# Altium project Node.PrjPCB (part 1 of 3)
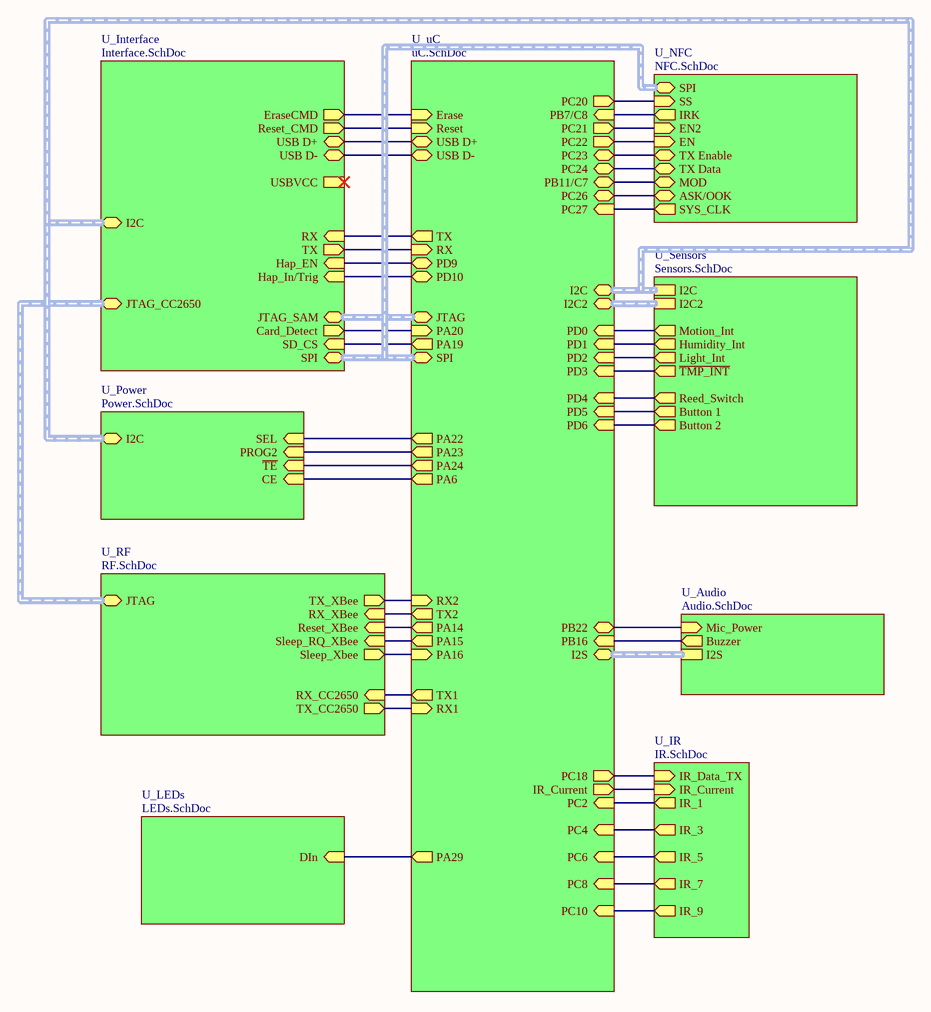
[diagram p0: Node.SchDoc]
11 sheets, 309 parts. Net scope: hierarchical (ports join the sheet entries above them; power ports are global).
Board file: Node.PcbDoc
Sheets:
  Node.SchDoc
    U_NFC = NFC.SchDoc
    U_Interface = Interface.SchDoc
      U_LevelShifter = LevelShifter.SchDoc
    U_IR = IR.SchDoc
    U_LEDs = LEDs.SchDoc
    U_Power = Power.SchDoc
    U_RF = RF.SchDoc
    U_uC = uC.SchDoc
    U_Sensors = Sensors.SchDoc
    U_Audio = Audio.SchDoc

## Sheet Node.SchDoc
size Letter

### Sub-sheets
U_Audio = Audio.SchDoc: Mic_Power (in), Buzzer (out), I2S (harness I2S)
U_Interface = Interface.SchDoc: USB D+ (bidir), USB D- (bidir), EraseCMD (out), Reset_CMD (out), USBVCC, Card_Detect (out), SD_CS (in), Hap_EN (in), Hap_In/Trig (in), SPI (harness SPI), JTAG_SAM (harness JTAG), JTAG_CC2650 (harness JTAG), I2C (harness I2C), RX (in), TX (out)
U_IR = IR.SchDoc: IR_1 (out), IR_3 (out), IR_5 (out), IR_7 (out), IR_9 (out), IR_Data_TX (in), IR_Current (in)
U_LEDs = LEDs.SchDoc: DIn (in)
U_NFC = NFC.SchDoc: MOD (bidir), IRK (out), ASK/OOK (bidir), SYS_CLK (out), EN2 (in), EN (in), TX Enable (bidir), TX Data (bidir), SS (in), SPI (harness SPI)
U_Power = Power.SchDoc: SEL (in), PROG2 (in), ~{TE} (in), CE (in), I2C (harness I2C)
U_RF = RF.SchDoc: RX_CC2650 (in), TX_CC2650 (out), TX_XBee (out), RX_XBee (in), Reset_XBee (in), Sleep_Xbee (out), Sleep_RQ_XBee (in), JTAG (harness JTAG)
U_Sensors = Sensors.SchDoc: Button 1 (out), Motion_Int (out), Humidity_Int (out), Light_Int (out), Reed_Switch (out), Button 2 (out), I2C (harness I2C), I2C2 (harness I2C), ~{TMP_INT} (out)
U_uC = uC.SchDoc: USB D+ (bidir), USB D- (bidir), IR_Current (out), Reset (in), Erase (in), I2C2 (harness I2C), I2C (harness I2C), JTAG (harness JTAG), SPI (harness SPI), I2S (harness I2S), TX (out), TX1 (out), RX (in), TX2 (out), RX1 (in), RX2 (in), PB16 (in), PB22 (bidir), PC4 (in), PC2 (in), PC6 (in), PC8 (in), PC10 (in), PC18 (out), PA20 (in), PA19 (out), PA22 (out), PA23 (out), PA24 (out), PA6 (out), PA29 (out), PC20 (out), PB7/C8 (in), PC22 (out), PC23 (bidir), PC24 (bidir), PB11/C7 (bidir), PC26 (bidir), PC27 (in), PD0 (in), PD1 (in), PD2 (in), PD5 (in), PD6 (in), PD3 (in), PD4 (in), PD9 (bidir), PD10 (bidir), PA15 (out), PA16 (in), PA14 (out), PC21 (out)

### Nets
CE: sheet U_Power/CE, sheet U_uC/PA6
PROG2: sheet U_Power/PROG2, sheet U_uC/PA23
Reset: sheet U_Interface/Reset_CMD, sheet U_uC/Reset
SAM_RX: sheet U_Interface/TX, sheet U_uC/RX
SAM_TX: sheet U_Interface/RX, sheet U_uC/TX
SEL: sheet U_Power/SEL, sheet U_uC/PA22
~{TE}: sheet U_Power/~{TE}, sheet U_uC/PA24
USB_1_N: sheet U_Interface/USB D-, sheet U_uC/USB D-
USB_1_P: sheet U_Interface/USB D+, sheet U_uC/USB D+
NetC7_2: sheet U_Interface/Hap_In/Trig, sheet U_uC/PD10
NetC12_1: sheet U_Interface/Card_Detect, sheet U_uC/PA20
NetC56_1: sheet U_uC/PD4, sheet U_Sensors/Reed_Switch
NetC60_1: sheet U_uC/PD5, sheet U_Sensors/Button 1
NetC64_1: sheet U_uC/PD6, sheet U_Sensors/Button 2
NetC115_2: sheet U_uC/PB22, sheet U_Audio/Mic_Power
NetCC1_41: sheet U_RF/RX_CC2650, sheet U_uC/TX1
NetCC1_42: sheet U_RF/TX_CC2650, sheet U_uC/RX1
NetJ1_2: sheet U_RF/TX_XBee, sheet U_uC/RX2
NetJ1_3: sheet U_RF/RX_XBee, sheet U_uC/TX2
NetJ1_5: sheet U_RF/Reset_XBee, sheet U_uC/PA14
NetJ1_9: sheet U_RF/Sleep_RQ_XBee, sheet U_uC/PA15
NetJ4_2: sheet U_Interface/SD_CS, sheet U_uC/PA19
NetJ7_8: sheet U_RF/Sleep_Xbee, sheet U_uC/PA16
NetQ1_3: sheet U_Interface/EraseCMD, sheet U_uC/Erase
NetQ8_1: sheet U_IR/IR_Data_TX, sheet U_uC/PC18
NetR51_1: sheet U_uC/PD3, sheet U_Sensors/~{TMP_INT}
NetR67_2: sheet U_IR/IR_Current, sheet U_uC/IR_Current
NetR81_1: sheet U_uC/PB16, sheet U_Audio/Buzzer
NetR95_1: sheet U_LEDs/DIn, sheet U_uC/PA29
NetU12_4: sheet U_uC/PD2, sheet U_Sensors/Light_Int
NetU15_12: sheet U_uC/PD0, sheet U_Sensors/Motion_Int
NetU17_A2: sheet U_IR/IR_3, sheet U_uC/PC4
NetU17_A3: sheet U_Interface/Hap_EN, sheet U_uC/PD9
NetU17_A4: sheet U_NFC/ASK/OOK, sheet U_uC/PC26
NetU17_A5: sheet U_NFC/TX Data, sheet U_uC/PC24
NetU17_A6: sheet U_NFC/SS, sheet U_uC/PC20
NetU17_A11: sheet U_IR/IR_1, sheet U_uC/PC2
NetU17_B5: sheet U_NFC/TX Enable, sheet U_uC/PC23
NetU17_C5: sheet U_NFC/EN, sheet U_uC/PC22
NetU17_C6: sheet U_NFC/EN2, sheet U_uC/PC21
NetU17_C7: sheet U_NFC/MOD, sheet U_uC/PB11/C7
NetU17_C8: sheet U_NFC/IRK, sheet U_uC/PB7/C8
NetU17_C11: sheet U_IR/IR_9, sheet U_uC/PC10
NetU17_D6: sheet U_NFC/SYS_CLK, sheet U_uC/PC27
NetU17_H12: sheet U_uC/PD1, sheet U_Sensors/Humidity_Int
NetU17_K7: sheet U_IR/IR_5, sheet U_uC/PC6
NetU17_M9: sheet U_IR/IR_7, sheet U_uC/PC8

### Buses and harness runs
harness sheet U_Audio/I2S = sheet U_uC/I2S
harness sheet U_Interface/I2C = sheet U_Power/I2C = sheet U_Sensors/I2C = sheet U_uC/I2C
harness sheet U_Interface/JTAG_CC2650 = sheet U_RF/JTAG
harness sheet U_Interface/JTAG_SAM = sheet U_uC/JTAG
harness sheet U_Interface/SPI = sheet U_NFC/SPI = sheet U_uC/SPI
harness sheet U_Sensors/I2C2 = sheet U_uC/I2C2

### Notes on the sheet
- Title
- Size:
- Date:
- Letter
- Number:
- Time:
- Revision:
- Sheet
- of
- File:

## Sheet NFC.SchDoc
size A
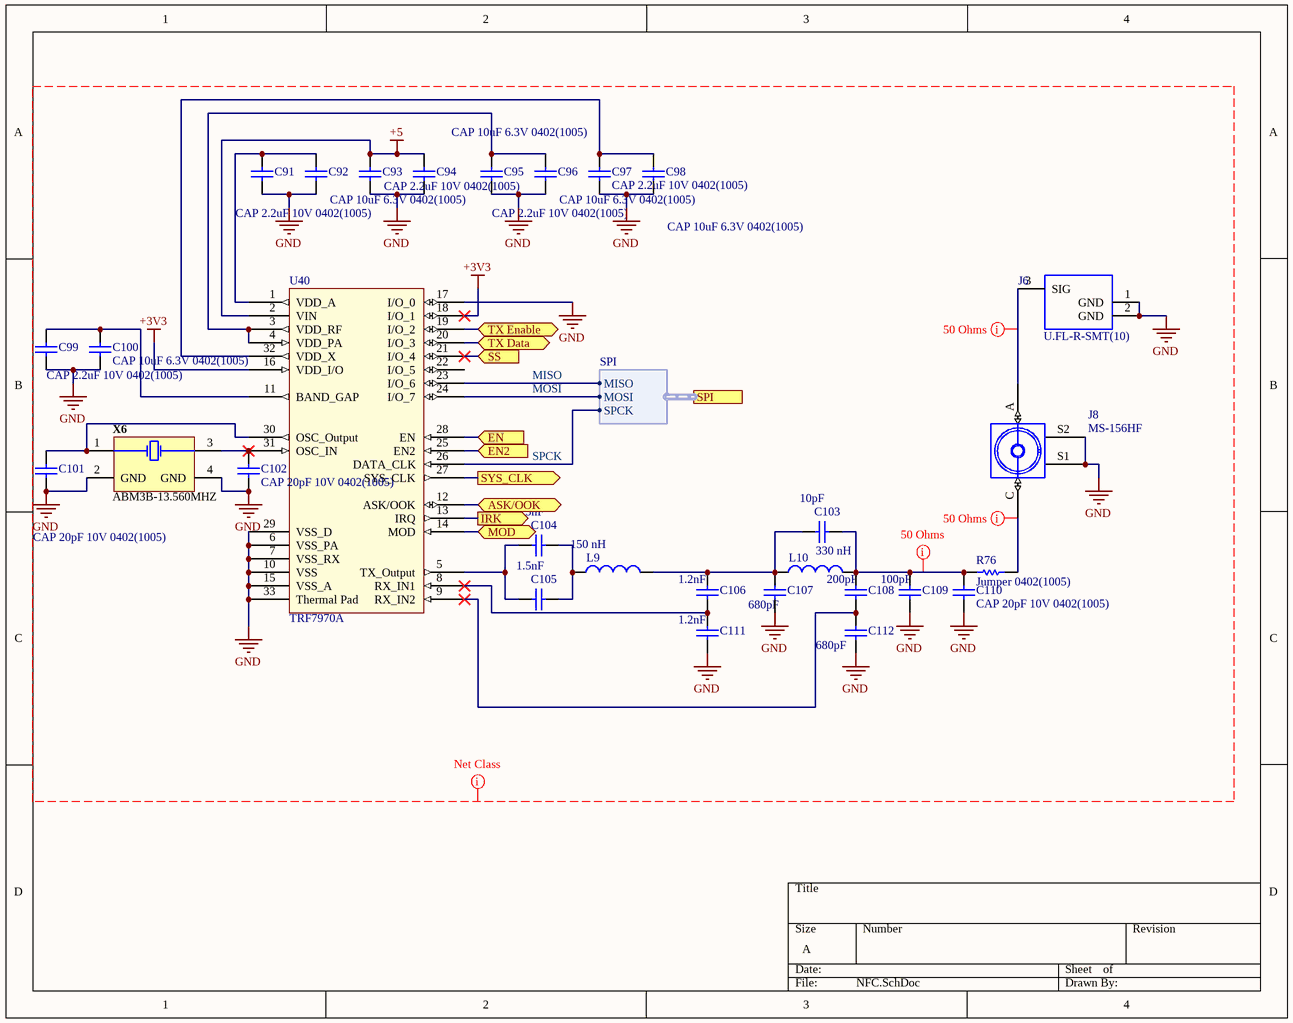
[diagram p1: NFC.SchDoc]

### Parts
C91  CAP 2.2uF 10V 0402(1005)  [CAPC0402(1005)60_L]
C92  CAP 10uF 6.3V 0402(1005)  [CAPC0402(1005)60_L]
C93  CAP 2.2uF 10V 0402(1005)  [CAPC0402(1005)60_L]
C94  CAP 10uF 6.3V 0402(1005)  [CAPC0402(1005)60_L]
C95  CAP 2.2uF 10V 0402(1005)  [CAPC0402(1005)60_L]
C96  CAP 10uF 6.3V 0402(1005)  [CAPC0402(1005)60_L]
C97  CAP 2.2uF 10V 0402(1005)  [CAPC0402(1005)60_L]
C98  CAP 10uF 6.3V 0402(1005)  [CAPC0402(1005)60_L]
C99  CAP 2.2uF 10V 0402(1005)  [CAPC0402(1005)60_L]
C100  CAP 10uF 6.3V 0402(1005)  [CAPC0402(1005)60_L]
C101  CAP 20pF 10V 0402(1005)  [CAPC0402(1005)60_L]
C102  CAP 20pF 10V 0402(1005)  [CAPC0402(1005)60_L]
C103  value 10pF  [CAPC0402(1005)60_L]  (hidden comment: CAP 10pF 10V 0402(1005))
C104  value 1.5nF  [CAPC0402(1005)60_L]  (hidden comment: CAP 1.5nF 10V 0402(1005))
C105  value 1.5nF  [CAPC0402(1005)60_L]  (hidden comment: CAP 1.5nF 10V 0402(1005))
C106  value 1.2nF  [CAPC0402(1005)60_L]  (hidden comment: CAP 1.2nF 10V 0402(1005))
C107  value 680pF  [CAPC0402(1005)60_L]  (hidden comment: CAP 680pF 6.3V 0402(1005))
C108  value 200pF  [CAPC0402(1005)60_L]  (hidden comment: CAP 200pF 10V 0402(1005))
C109  value 100pF  [CAPC0402(1005)60_L]  (hidden comment: CAP 100pF 10V 0402(1005))
C110  CAP 20pF 10V 0402(1005)  [CAPC0402(1005)60_L]
C111  value 1.2nF  [CAPC0402(1005)60_L]  (hidden comment: CAP 1.2nF 10V 0402(1005))
C112  value 680pF  [CAPC0402(1005)60_L]  (hidden comment: CAP 680pF 6.3V 0402(1005))
J6  U.FL-R-SMT(10)  [HRS-U.FL-R-SMT_V]
J8  MS-156HF  [MS-156HF]
L9  Inductance: 150 nH  [COIL-1008CS_V]  (hidden comment: 1008CS-1501X_FLC)
L10  Inductance: 330 nH  [COIL-1008CS_V]  (hidden comment: 1008CS-3301X_FLC)
R76  Jumper 0402(1005)  [RESC0402(1005)_L]
U40  TRF7970A  [QFN50P500X500X100_HS-33N]
X6  ABM3B-13.560MHZ  [ABRA-ABM3B-4_V]

### Ports
ASK/OOK (bidir), EN2 (in), EN (in), IRK (out), MOD (bidir), SPI (harness SPI), SS (in), SYS_CLK (out), TX Data (bidir), TX Enable (bidir)

### Harnesses
SPI: MISO, MOSI, SPCK

### Nets
+3V3: U40.16(VDD_I/O) U40.18(I/O_1)
+5: C93.2 C94.2 U40.2(VIN)
GND: C91.1 C92.1 C93.1 C94.1 C95.1 C96.1 C97.1 C98.1 C99.1 C100.1 C101.2 C102.2 C107.1 C109.1 C110.2 C111.1 C112.1 J6.1(GND) J6.2(GND) J8.S1 J8.S2 U40.6(VSS_PA) U40.7(VSS_RX) U40.10(VSS) U40.15(VSS_A) U40.17(I/O_0) U40.29(VSS_D) U40.33(Thermal_Pad) X6.2(GND) X6.4(GND)
MISO: U40.23(I/O_6) ; port SPI.MISO
MOSI: U40.24(I/O_7) ; port SPI.MOSI
SPCK: U40.26(DATA_CLK) ; port SPI.SPCK
NetC91_2: C91.2 C92.2 U40.1(VDD_A)
NetC95_2: C95.2 C96.2 U40.3(VDD_RF) U40.4(VDD_PA)
NetC97_2: C97.2 C98.2 U40.32(VDD_X)
NetC99_2: C99.2 C100.2 U40.11(BAND_GAP)
NetC101_1: C101.1 U40.30(OSC_Output) X6.1(X1)
NetC102_1: C102.1 U40.31(OSC_IN) X6.3(X2)
NetC103_1: C103.1 C106.2 C107.2 L9.2 L10.1
NetC103_2: C103.2 C108.2 C109.2 C110.1 L10.2 R76.1
NetC104_1: C104.1 C105.1 U40.5(TX_Output)
NetC104_2: C104.2 C105.2 L9.1
NetC106_1: C106.1 C111.2 U40.8(RX_IN1)
NetC108_1: C108.1 C112.2 U40.9(RX_IN2)
NetJ6_3: J6.3(SIG) J8.A
NetJ8_C: J8.C R76.2
NetU17_A4: U40.12(ASK/OOK) ; port ASK/OOK
NetU17_A5: U40.20(I/O_3) ; port TX Data
NetU17_A6: U40.21(I/O_4) ; port SS
NetU17_B5: U40.19(I/O_2) ; port TX Enable
NetU17_C5: U40.28(EN) ; port EN
NetU17_C6: U40.25(EN2) ; port EN2
NetU17_C7: U40.14(MOD) ; port MOD
NetU17_C8: U40.13(IRQ) ; port IRK
NetU17_D6: U40.27(SYS_CLK) ; port SYS_CLK

Not connected (* = marked no-connect by the designer): U40 22(I/O_5)

### Layout directives
net class 50_Ohms: NetC103_2, NetJ6_3, NetJ8_C
net class NFC: +3V3, +5, GND, MISO, MOSI, SPCK

### Library data of the parts
C91 C93 C95 C97 C99 = CMP-1034-02128-1: CAP 2.2uF 10V ±20% 0402 (1005 Metric) Thickness 0.6mm SMD; Case-EIA: 0402; Tolerance: Â±20%; Case-Metric: 1005; Value: 2.2uF; Rated Voltage: 10 V; Technology: SMT; Max Thickness: 0.6 mm
C92 C94 C96 C98 C100 = CMP-1034-02138-1: CAP 10uF 6.3V ±20% 0402 (1005 Metric) Thickness 0.6mm SMD; Case-Metric: 1005; Case-EIA: 0402; Tolerance: Â±20%; Rated Voltage: 6.3 V; Technology: SMT; Max Thickness: 0.6 mm; Value: 10uF
C101 C102 C110 = CMP-1034-00874-1: CAP 20pF 10V ±5% 0402 (1005 Metric) Thickness 0.6mm SMD; Case-EIA: 0402; Tolerance: Â±5%; Case-Metric: 1005; Value: 20pF; Rated Voltage: 10 V; Technology: SMT; Max Thickness: 0.6 mm
C103 = CMP-1034-00703-1: CAP 10pF 10V ±10% 0402 (1005 Metric) Thickness 0.6mm SMD; Tolerance: Â±10%; Case-EIA: 0402; Case-Metric: 1005; Rated Voltage: 10 V; Technology: SMT; Max Thickness: 0.6 mm
C104 C105 = CMP-1034-01671-1: CAP 1.5nF 10V ±5% 0402 (1005 Metric) Thickness 0.6mm SMD; Tolerance: Â±5%; Case-EIA: 0402; Case-Metric: 1005; Technology: SMT; Max Thickness: 0.6 mm; Rated Voltage: 10 V
C106 C111 = CMP-1034-01643-1: CAP 1.2nF 10V ±5% 0402 (1005 Metric) Thickness 0.6mm SMD; Tolerance: Â±5%; Case-EIA: 0402; Case-Metric: 1005; Technology: SMT; Rated Voltage: 10 V; Max Thickness: 0.6 mm
C107 C112 = CMP-1034-01542-1: CAP 680pF 6.3V ±10% 0402 (1005 Metric) Thickness 0.6mm SMD; Case-EIA: 0402; Tolerance: Â±10%; Case-Metric: 1005; Rated Voltage: 6.3 V; Max Thickness: 0.6 mm; Technology: SMT
C108 = CMP-1034-01342-1: CAP 200pF 10V ±1% 0402 (1005 Metric) Thickness 0.6mm SMD; Case-EIA: 0402; Tolerance: Â±1%; Case-Metric: 1005; Technology: SMT; Rated Voltage: 10 V; Max Thickness: 0.6 mm
C109 = CMP-1034-01232-1: CAP 100pF 10V ±10% 0402 (1005 Metric) Thickness 0.6mm SMD; Case-EIA: 0402; Case-Metric: 1005; Tolerance: Â±10%; Rated Voltage: 10 V; Max Thickness: 0.6 mm; Technology: SMT
J6 = CMP-0029-00003-1: Ultra Small Surface Mount Coaxial Connector, 50 Ohm, -40 to 90 degC, 3-Pin SMD, RoHS, Tape and Reel; Current Rating: 3 A; DatasheetVersion: Aug-16; Mount: Through Hole; Contact Material: Bronze; Length: 101.19 mm; Radiation Hardening: No; Height: 8.13 mm; ComponentLink1Description: Manufacturer URL; Pins: 80; Package Quantity: 50; ComponentLink2URL: https://www.hirose.com/product/en/download_file/key_name/U.FL/category/Catalog/doc_file_id/31697/?file_category_id=4&item_id=15&is_series=1; Lead Pitch: 2.54 mm; Max Operating Temperature: 105degC; Width: 4.88 mm; RoHSCompliant: True; Contact Plating: Tin; PackageReference: U.FL-R-SMT; Packaging: Bulk; Contact Finish: Lead; PackageDescription: 3-Pin Surface Mount Device, Body 2.6 x 2.6 mm; Min Operating Temperature: -65degC; ComponentLink1URL: https://www.hirose.com; ComponentLink2Description: Datasheet; Colour: Black
J8 = MS-156HF: Subminiature Coaxial Swtich, 1.6mm High, DC - 6GHz
L9 = CMP-00022-0015-A.1: Chip Inductor, 150 nH, +/- 1%, -40 to 125 degC, 2-Pin SMD, RoHS, Tape and Reel; ComponentLink1Description: Manufacturer URL; ComponentLink1URL: http://www.coilcraft.com/; ComponentLink2Description: Datasheet; ComponentLink2URL: http://www.coilcraft.com/pdfs/1008cs.pdf; DatasheetVersion: Oct-15; Mounting Technology: Surface Mount; PackageDescription: 2-Pin Surface Mount Device, Body 2.92 x 2.79 mm; PartNumber: 1008CS-1501X_FLC; RoHSCompliant: TRUE
L10 = CMP-00022-0019-A.1: Chip Inductor, 330 nH, +/- 1%, -40 to 125 degC, 2-Pin SMD, RoHS, Tape and Reel; ComponentLink1Description: Manufacturer URL; ComponentLink1URL: http://www.coilcraft.com/; ComponentLink2Description: Datasheet; ComponentLink2URL: http://www.coilcraft.com/pdfs/1008cs.pdf; DatasheetVersion: Oct-15; Mounting Technology: Surface Mount; PackageDescription: 2-Pin Surface Mount Device, Body 2.92 x 2.79 mm; PartNumber: 1008CS-3301X_FLC; RoHSCompliant: TRUE
R76 = CMP-1011-00001-1: Jumper 0402 (1005 Metric); Case-Metric: 1005; Value: 0.00 Ohm; Power: None; Case-EIA: 0402; Technology: SMT; Tolerance: None
X6 = CMP-1688-00008-1: Ceramic SMD Crystal, 13.56 MHz, +/- 20 ppm, 50 Ohm, -20 to 70 degC, 4-Pin SMD, RoHS, Tape and Reel; Impedance: 50 Ohm; Mating Cycles: 30; Contact Material: Brass; Contact Plating: Gold; PackageReference: ABM3B; Min Operating Temperature: -40 degC; ComponentLink2Description: Datasheet; Radiation Hardening: No; DatasheetVersion: Aug-15; Packaging: Tape and Reel; Length: 2.6 mm; Package Quantity: 2500; REACH SVHC: Unknown; PackageDescription: 4-Pin Surface Mount Device, Body 5 x 3.2 mm; Weight: 0.001058 oz; ComponentLink2URL: http://www.abracon.com/Resonators/abm3b.pdf; ComponentLink1Description: Manufacturer URL; Width: 3 mm; RoHSCompliant: true; Fastening Type: Snap; Max Operating Temperature: 155 degC; ComponentLink1URL: http://www.abracon.com/; Frequency: 13.56 MHz; Height: 1.244 mm; Mount: Surface Mount

## Sheet Interface.SchDoc
size Legal
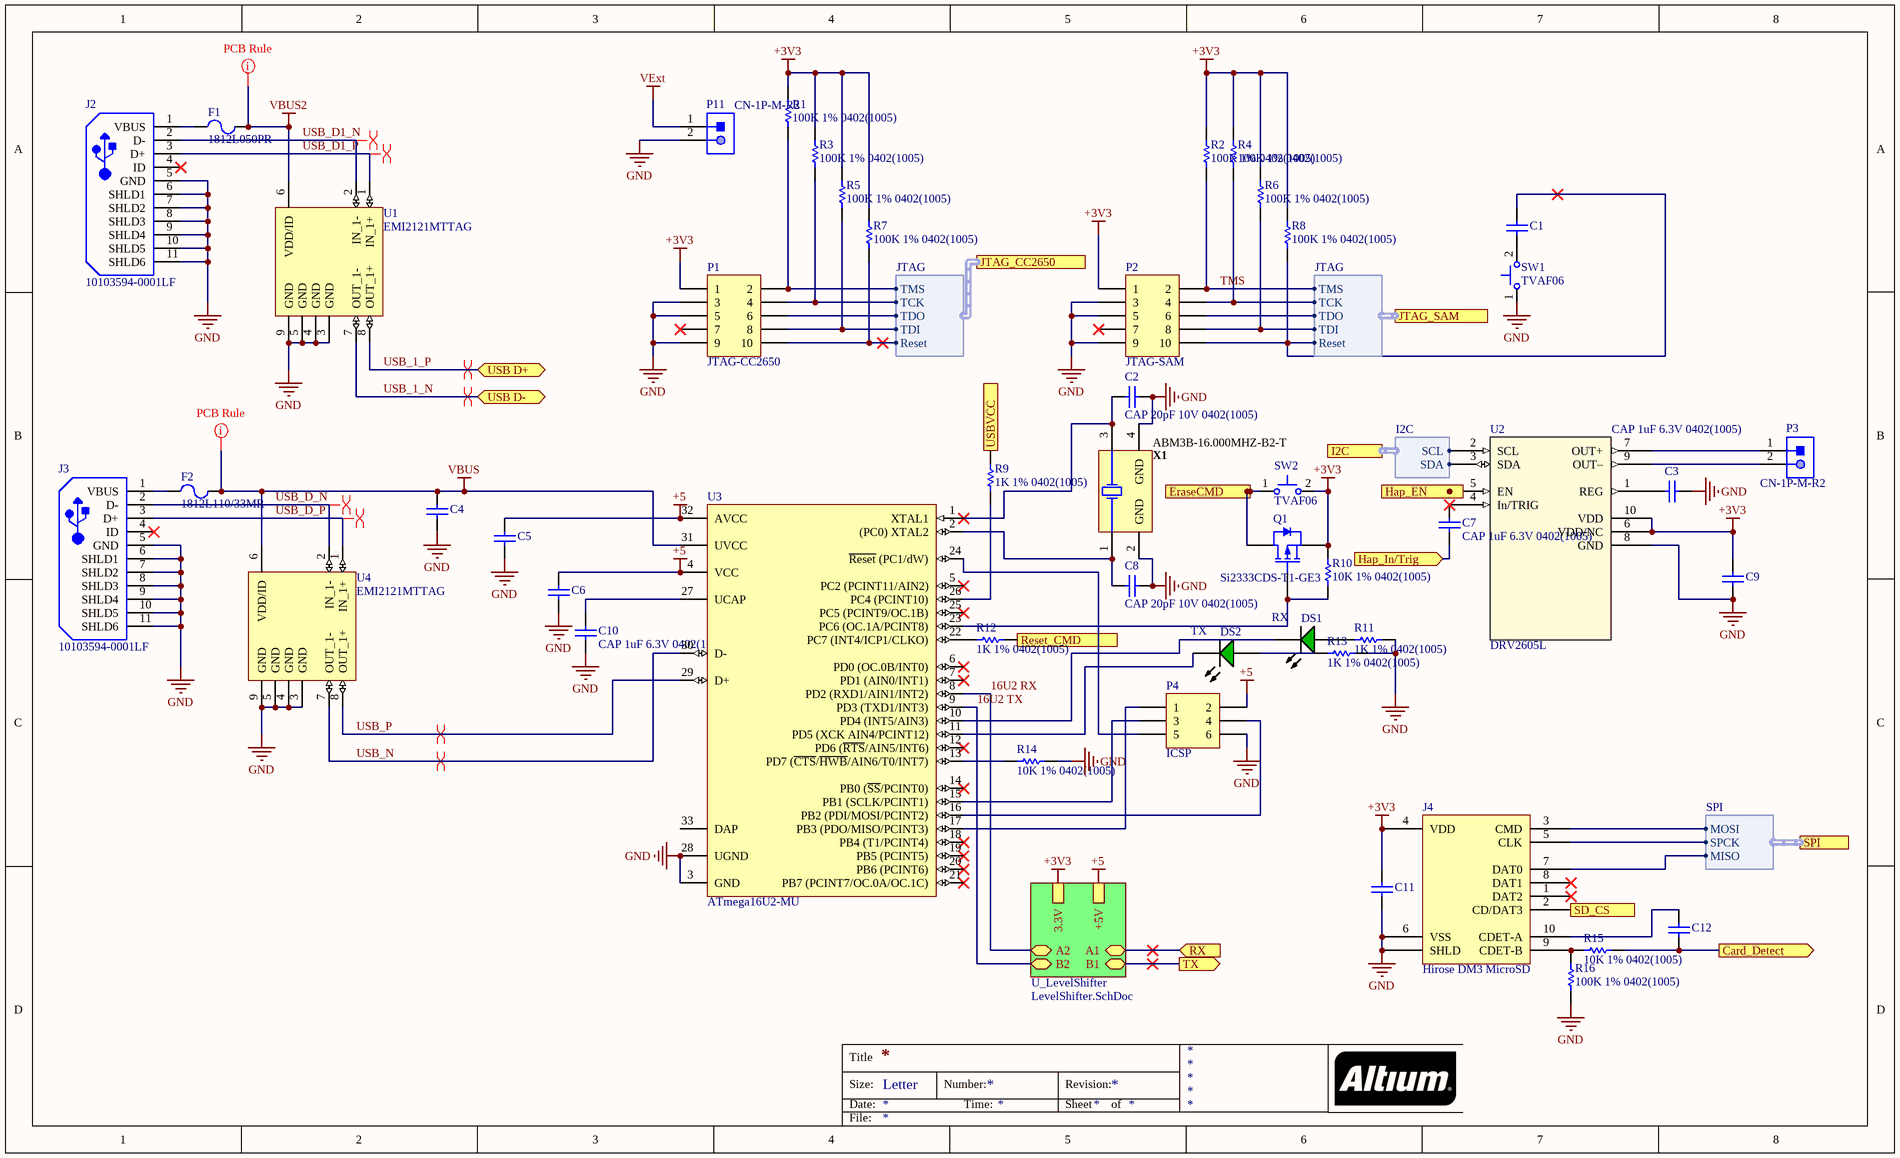
[diagram p2: Interface.SchDoc]

### Parts
C1  CAP 100nF 10V 0402(1005)  [CAPC0402(1005)60_L]  (value not drawn)
C2  CAP 20pF 10V 0402(1005)  [CAPC0402(1005)60_L]
C3  CAP 1uF 6.3V 0402(1005)  [CAPC0402(1005)60_L]
C4  CAP 100nF 10V 0402(1005)  [CAPC0402(1005)60_L]  (value not drawn)
C5  CAP 100nF 10V 0402(1005)  [CAPC0402(1005)60_L]  (value not drawn)
C6  CAP 100nF 10V 0402(1005)  [CAPC0402(1005)60_L]  (value not drawn)
C7  CAP 1uF 6.3V 0402(1005)  [CAPC0402(1005)60_L]
C8  CAP 20pF 10V 0402(1005)  [CAPC0402(1005)60_L]
C9  CAP 100nF 10V 0402(1005)  [CAPC0402(1005)60_L]  (value not drawn)
C10  CAP 1uF 6.3V 0402(1005)  [CAPC0402(1005)60_L]
C11  CAP 100nF 10V 0402(1005)  [CAPC0402(1005)60_L]  (value not drawn)
C12  CAP 100nF 10V 0402(1005)  [CAPC0402(1005)60_L]  (value not drawn)
DS1  RX  [LTST-C190GKT_V]
DS2  TX  [LTST-C190GKT_V]
F1  1812L050PR  [LFUS-1812L050_V]
F2  1812L110/33MR  [LFUS-1812L11033MR_V]
J2  10103594-0001LF  [FCI-10103594-0001LF_V]
J3  10103594-0001LF  [FCI-10103594-0001LF_V]
J4  Hirose DM3 MicroSD  [HIROSE DM3AT-SF-PEJM5]
P1  JTAG-CC2650  [MHDR2X5]
P2  JTAG-SAM  [MHDR2X5]
P3  CN-1P-M-R2  [B2B-PH-K-S]
P4  ICSP  [MHDR2X3]
P11  CN-1P-M-R2  [B2B-PH-K-S]
Q1  Si2333CDS-T1-GE3  [DIOD-SOT23-3_V]
R1  100K 1% 0402(1005)  [RESC0402(1005)_L]
R2  100K 1% 0402(1005)  [RESC0402(1005)_L]
R3  100K 1% 0402(1005)  [RESC0402(1005)_L]
R4  100K 1% 0402(1005)  [RESC0402(1005)_L]
R5  100K 1% 0402(1005)  [RESC0402(1005)_L]
R6  100K 1% 0402(1005)  [RESC0402(1005)_L]
R7  100K 1% 0402(1005)  [RESC0402(1005)_L]
R8  100K 1% 0402(1005)  [RESC0402(1005)_L]
R9  1K 1% 0402(1005)  [RESC0402(1005)_L]
R10  10K 1% 0402(1005)  [RESC0402(1005)_L]
R11  1K 1% 0402(1005)  [RESC0402(1005)_L]
R12  1K 1% 0402(1005)  [RESC0402(1005)_L]
R13  1K 1% 0402(1005)  [RESC0402(1005)_L]
R14  10K 1% 0402(1005)  [RESC0402(1005)_L]
R15  10K 1% 0402(1005)  [RESC0402(1005)_L]
R16  100K 1% 0402(1005)  [RESC0402(1005)_L]
SW1  TVAF06  [JNFU-TVAF06_V]
SW2  TVAF06  [JNFU-TVAF06_V]
U1  EMI2121MTTAG  [ONSC-WDFN-8-511BN_V]
U2  DRV2605L  [TSSOP50P490X110-10N]
U3  ATmega16U2-MU  [32PG_N]
U4  EMI2121MTTAG  [ONSC-WDFN-8-511BN_V]
X1  ABM3B-16.000MHZ-B2-T  [ABRA-ABM3B-4_V]

### Sub-sheets
U_LevelShifter = LevelShifter.SchDoc: 3.3V, A1 (bidir), A2 (bidir), +5V, B2 (bidir), B1 (bidir)

### Ports
Card_Detect (out), EraseCMD (out), Hap_EN (in), Hap_In/Trig (in), I2C (harness I2C), JTAG_CC2650 (harness JTAG), JTAG_SAM (harness JTAG), Reset_CMD (out), RX (in), SD_CS (in), SPI (harness SPI), TX (out), USB D+ (bidir), USB D- (bidir), USBVCC

### Harnesses
SPI: MISO, MOSI, SPCK
JTAG: TMS, TCK, TDO, TDI, Reset
I2C: SCL, SDA

### Nets
+3V3: C9.1 C11.2 J4.4(VDD) P1.1 P2.1 Q1.2(S) R1.2 R2.2 R3.2 R4.2 R5.2 R6.2 R7.2 R8.2 R10.2 SW2.2 U2.6(VDD/NC) U2.10(VDD) ; sheet U_LevelShifter/3.3V
+5: C5.1 C6.1 P4.2 U3.4(VCC) U3.32(AVCC) ; sheet U_LevelShifter/+5V
GND: C2.2 C3.1 C4.2 C5.2 C6.2 C8.2 C9.2 C10.1 C11.1 J2.5(GND) J2.6(SHLD1) J2.7(SHLD2) J2.8(SHLD3) J2.9(SHLD4) J2.10(SHLD5) J2.11(SHLD6) J3.5(GND) J3.6(SHLD1) J3.7(SHLD2) J3.8(SHLD3) J3.9(SHLD4) J3.10(SHLD5) J3.11(SHLD6) J4.6(VSS) J4.S(SHLD) P1.3 P1.5 P1.9 P2.3 P2.5 P2.9 P4.6 P11.2 R11.2 R13.2 R14.2 R16.2 SW1.1 U1.3(GND) U1.4(GND) U1.5(GND) U1.9(GND) U2.8(GND) U3.3(GND) U3.28(UGND) U4.3(GND) U4.4(GND) U4.5(GND) U4.9(GND) X1.2(GND) X1.4(GND)
VBUS: C4.1 F2.2 U3.31(UVCC) U4.6(VDD/ID)
VBUS2: F1.2 U1.6(VDD/ID)
VExt: P11.1
16U2 RX: U3.8(PD2_(RXD1/AIN1/INT2)) ; sheet U_LevelShifter/A2
16U2 TX: U3.9(PD3_(TXD1/INT3)) ; sheet U_LevelShifter/B2
MISO: J4.7(DAT0) ; port SPI.MISO
MOSI: J4.3(CMD) ; port SPI.MOSI
Reset: C1.2 P2.10 R8.1 R12.2 ; port Reset_CMD, port JTAG_SAM.Reset
SAM_RX: port TX, sheet U_LevelShifter/B1
SAM_TX: port RX, sheet U_LevelShifter/A1
SCL: U2.2(SCL) ; port I2C.SCL
SDA: U2.3(SDA) ; port I2C.SDA
SPCK: J4.5(CLK) ; port SPI.SPCK
TMS: P2.2 R2.1 ; port JTAG_SAM.TMS
USB_1_N: U1.7(OUT_1-) ; port USB D-
USB_1_P: U1.8(OUT_1+) ; port USB D+
USB_D1_N: J2.2(D-) U1.2(IN_1-)
USB_D1_P: J2.3(D+) U1.1(IN_1+)
USB_D_N: J3.2(D-) U4.2(IN_1-)
USB_D_P: J3.3(D+) U4.1(IN_1+)
USB_N: U3.30(D-) U4.7(OUT_1-)
USB_P: U3.29(D+) U4.8(OUT_1+)
NetC1_1: C1.1 SW1.2
NetC2_1: C2.1 U3.1(XTAL1) X1.3(X2)
NetC3_2: C3.2 U2.1(REG)
NetC7_1: C7.1 U2.4(In/TRIG)
NetC7_2: C7.2 ; port Hap_In/Trig
NetC8_1: C8.1 U3.2((PC0)_XTAL2) X1.1(X1)
NetC10_2: C10.2 U3.27(UCAP)
NetC12_1: C12.1 R15.2 ; port Card_Detect
NetC12_2: C12.2 J4.10(CDET-A)
NetC38_2: P1.10 R7.1 ; port JTAG_CC2650.Reset
NetCC1_24: P1.2 R1.1 ; port JTAG_CC2650.TMS
NetCC1_25: P1.4 R3.1 ; port JTAG_CC2650.TCK
NetCC1_26: P1.6 ; port JTAG_CC2650.TDO
NetCC1_27: P1.8 R5.1 ; port JTAG_CC2650.TDI
NetDS1_1: DS1.1(A) R11.1
NetDS1_2: DS1.2(K) U3.10(PD4_(INT5/AIN3))
NetDS2_1: DS2.1(A) R13.1
NetDS2_2: DS2.2(K) U3.11(PD5_(XCK_AIN4/PCINT12))
NetF1_1: F1.1 J2.1(VBUS)
NetF2_1: F2.1 J3.1(VBUS)
NetJ4_2: J4.2(CD/DAT3) ; port SD_CS
NetJ4_9: J4.9(CDET-B) R15.1 R16.1
NetP2_4: P2.4 R4.1 ; port JTAG_SAM.TCK
NetP2_6: P2.6 ; port JTAG_SAM.TDO
NetP2_8: P2.8 R6.1 ; port JTAG_SAM.TDI
NetP3_1: P3.1 U2.7(OUT+)
NetP3_2: P3.2 U2.9(OUT–)
NetP4_1: P4.1 U3.17(PB3_(PDO/MISO/PCINT3))
NetP4_3: P4.3 U3.15(PB1_(SCLK/PCINT1))
NetP4_4: P4.4 U3.16(PB2_(PDI/MOSI/PCINT2))
NetP4_5: P4.5 U3.24(~{Reset}_(PC1/dW))
NetQ1_1: Q1.1(G) R10.1 U3.23(PC6_(OC.1A/PCINT8))
NetQ1_3: Q1.3(D) SW2.1 ; port EraseCMD
NetR9_1: R9.1 U3.26(PC4_(PCINT10))
NetR9_2: R9.2 ; port USBVCC
NetR12_1: R12.1 U3.22(PC7_(INT4/ICP1/CLKO))
NetR14_1: R14.1 U3.13(PD7_(~{CTS}/~{HWB}/AIN6/T0/INT7))

Not connected (* = marked no-connect by the designer): J2 4(ID)*; J3 4(ID)*; J4 1(DAT2)* 8(DAT1)*; P1 7*; P2 7*; U2 5(EN); U3 5(PC2_(PCINT11/AIN2))* 6(PD0_(OC.0B/INT0))* 7(PD1_(AIN0/INT1))* 12(PD6_(~{RTS}/AIN5/INT6))* 14(PB0_(~{SS}/PCINT0))* 18(PB4_(T1/PCINT4))* 19(PB5_(PCINT5))* 20(PB6_(PCINT6))* 21(PB7_(PCINT7/OC.0A/OC.1C))* 25(PC5_(PCINT9/OC.1B))* 33(DAP)

### Layout directives
differential pair: USB_1_N, USB_1_P, USB_D1_N, USB_D1_P, USB_D_N, USB_D_P, USB_N, USB_P
rule Undefined: VBUS, VBUS2

### Notes on the sheet
- Title
- Size:
- Date:
- Letter
- Number:
- Time:
- Revision:
- Sheet
- of
- File:

### Library data of the parts
C1 C4-C6 C9 C11 C12 = CMP-1034-02066-1: CAP 100nF 10V ±20% 0402 (1005 Metric) Thickness 0.6mm SMD; Tolerance: Â±20%; Case-Metric: 1005; Case-EIA: 0402; Max Thickness: 0.6 mm; Rated Voltage: 10 V; Technology: SMT; Value: 100nF
C2 C8 = CMP-1034-00874-1: as C101 on sheet NFC; Value: 20pF; Rated Voltage: 10 V; Technology: SMT; Max Thickness: 0.6 mm
C3 C7 C10 = CMP-1034-02115-1: CAP 1uF 6.3V -20% to +80% 0402 (1005 Metric) Thickness 0.6mm SMD; Case-Metric: 1005; Case-EIA: 0402; Value: 1uF; Tolerance: -20% to +80%; Rated Voltage: 6.3 V; Max Thickness: 0.6 mm; Technology: SMT
DS1 DS2 = CMP-1674-00007-1: LED Uni-Color Green, 100 mW, 5 V, -55 to 85 degC, 2-Pin SMD, RoHS, Tape and Reel; ComponentLink2Description: Datasheet; ComponentLink2URL: http://datasheet.octopart.com/LTST-C190GKT-Lite-On-datasheet-158530.pdf; ComponentLink1Description: Manufacturer URL; PackageReference: C190GKT; PackageDescription: 2-Pin Surface Mount Device, Body 1.6 x 0.8 mm; ComponentLink1URL: http://www.us.liteon.com/; DatasheetVersion: Dec-06
F1 = CMP-1700-00002-1: POLY-FUSE(R) Resettable PTC, 0.5 A, 0.15 to 1 Ohm Resistance, -40 to 85 degC, 1812 (4532 Metric), RoHS, Tape and Reel; Voltage Rating: 50 V; Power Rating: 100 mW; Resistance: 150 kohm; Tolerance: 1%; Case\Package: 0603; ComponentLink2URL: http://www.littelfuse.com/~/media/electronics/datasheets/resettable_ptcs/littelfuse_ptc_1812l_datasheet.pdf.pdf; Pins: 2; Mount: Surface Mount; Width: 0.8 mm; Length: 1.6 mm; Package Quantity: 1; Max Operating Temperature: 155 degC; Case Code (Imperial): 0603; ComponentLink1Description: Manufacturer URL; PackageReference: 1812; ComponentLink1URL: http://www.littelfuse.com/; RoHSCompliant: true; Voltage Rating (DC): 50 V; Packaging: Tape and Reel; PackageDescription: 2-Pin Surface Mount Device, Body 4.55 x 3.24 mm; Min Operating Temperature: -55 degC; DatasheetVersion: Feb-16; REACH SVHC: No SVHC; Case Code (Metric): 1608; ComponentLink2Description: Datasheet; Height: 0.45 mm
F2 = CMP-1700-00004-1: Poly-Fuse (R) Resettable PTC, 0.8 W, 20 A, -40 to 85 degC, 2-Pin SMD, RoHS, Tape and Reel; Voltage Rating (DC): 100 V; Capacitance: 100 uF; Tolerance: 20%; Case\Package: Radial; Voltage Rating: 100 V; Packaging: Bulk; Max Operating Temperature: 85 degC; Length: 16 mm; ComponentLink1Description: Manufacturer URL; PackageReference: 1812L110/33MR; Pins: 2; PackageDescription: 2-Pin Surface Mount Device, Body 4.55 x 3.24 mm; ComponentLink2URL: http://www.littelfuse.com/~/media/electronics/datasheets/resettable_ptcs/littelfuse_ptc_1812l_datasheet.pdf.pdf; ComponentLink2Description: Datasheet; DatasheetVersion: Feb-16; Mount: Through Hole; Diameter: 10 mm; ComponentLink1URL: http://www.littelfuse.com/; Lead Pitch: 5 mm; Height: 16 mm; Package Quantity: 200; Radiation Hardening: No; RoHSCompliant: true; REACH SVHC: No SVHC; Min Operating Temperature: -40 degC
J2 J3 = CMP-1698-00007-1: Micro USB 2.0 B Receptacle, -55 to 85 degC, 5-Pin SMD, RoHS, Tape and Reel; Type (Resistor): Thick Film; Case\Package: 0603; Resistance: 4.7 kohm; Tolerance: 1%; Voltage Rating: 75 V; Power Rating: 100 mW; Case Code (Imperial): 0603; Case Code (Metric): 1608; REACH SVHC: Unknown; ComponentLink1URL: http://portal.fciconnect.com/; Package Quantity: 5000; RoHSCompliant: true; Max Operating Temperature: 155 degC; Min Operating Temperature: -55 degC; Mount: Surface Mount; Weight: 7.1E-05 oz; Length: 1.55 mm; PackageDescription: 5-Pin Surface Mount Device, Body 8.04 x 5.62 mm; Pins: 2; Height: 0.45 mm; ComponentLink2Description: Datasheet; ComponentLink2URL: http://portal.fciconnect.com/Comergent//fci/drawing/10103594.pdf; PackageReference: FCI-10103594-0001LF; DatasheetVersion: Rev. A, 06/2010; Width: 0.85 mm; Packaging: Tape and Reel; ComponentLink1Description: Manufacturer URL
P1 P2 = MHDR2X5: Header, 5-Pin, Dual row; LatestRevisionDate: 17-Jul-2002; LatestRevisionNote: Re-released for DXP Platform.; Publisher: Altium Limited
P4 = Header 3X2: Header, 3-Pin, Dual row; LatestRevisionDate: 17-Jul-2002; LatestRevisionNote: Re-released for DXP Platform.; Publisher: Altium Limited
Q1 = CMP-00020-0000-A.2: MOSFET 12V 5.1A 2.5W 35 mohms @ 4.5V; Manufacturer: Vishay; Channel Mode: Enhancement; Brand: Vishay Semiconductors; Rise Time: 35 ns; Transistor Polarity: P-Channel; Vgs - Gate-Source Voltage: 8 V; Number of Channels: 1 Channel; Pd - Power Dissipation: 1.25 W; Configuration: Single; Typical Turn-Off Delay Time: 45 ns; Transistor Type: 1 P-Channel; Vds - Drain-Source Breakdown Voltage: - 12 V; Typical Turn-On Delay Time: 13 ns; Tradename: TrenchFET; Standard Pack Qty: 3000; Reeling: True; Supplier Part Number: 781-SI2333CDS-T1-GE3; Series: SI2; Length: 3.04 mm; ComponentLink1URL: http://www.mouser.com/ds/2/427/si2333cd-244460.pdf; RoHS - Mouser: Y; Technology: Si; Width: 1.4 mm; Maximum Operating Temperature: + 150 C; Rds On - Drain-Source Resistance: 35 mOhms; Product: MOSFET Small Signal; Manufacturer Part Number: Si2333CDS-T1-GE3; Minimum Operating Temperature: - 55 C; Minimum Order Quantity: 1; Height: 1.02 mm; Supplier: Mouser; ComponentLink1Description: si2333cd-244460.pdf; Id - Continuous Drain Current: 5.1 A; Fall Time: 35 ns; Mounting Style: SMD/SMT; Package / Case: SOT-23-3; Packaging: Reel
R1-R8 R16 = CMP-1011-00736-1: 100K 0.063W 1% 0402 (1005 Metric)  SMD; Value: 100000.00 Ohm; Case-Metric: 1005; Case-EIA: 0402; Power: 0.063 W; Tolerance: 1 %; Technology: SMT
R9 R11-R13 = CMP-1011-00510-1: 1K 0.063W 1% 0402 (1005 Metric)  SMD; Case-EIA: 0402; Case-Metric: 1005; Value: 1000.00 Ohm; Technology: SMT; Tolerance: 1 %; Power: 0.063 W
R10 R14 R15 = CMP-1011-00623-1: 10K 0.063W 1% 0402 (1005 Metric)  SMD; Case-EIA: 0402; Value: 10000.00 Ohm; Case-Metric: 1005; Technology: SMT; Tolerance: 1 %; Power: 0.063 W
SW1 SW2 = CMP-0587-00001-2: Switch, SPST Push Button, 50 mA, 12 V DC, SMD, -30 to 85 degC, RoHS; Manufacturer: Jianfu; Contact Resistance: 100 mW max; Lifetime: 100000 Cycles min; Rating: 50 mA. 12 V DC; Insulation Resistance: 100 MW min. 100 V DC; Travel: 0.13 +/- 0.05 mm; Dielectric Strength: 250 V AC for 1 min; RoHS: TRUE; Mounting Technology: Surface Mount; PartNumber: TVAF06; PackageDescription: 2-Pin Switch, Push Button, SMD, Body 2.9 x 3.9 mm; ComponentLink1Description: Manufacturer URL; ComponentLink1URL: http://www.jian-fu.com/; Operating Temperature: -30 to 85 degC; ComponentLink2URL: http://en.jian-fu.com/product-22.html; PackageReference: TVAF06; ComponentLink2Description: Datasheet
U1 U4 = CMP-1066-00065-1: Single Pair Common Mode Filter with ESD Protection, -40 to 85 degC, 8-Pin WDFN, Pb-Free, Tape and Reel; Manufacturer: On Semiconductor; C Typ (pF): 0.8; Number of Lines: 3; VRWM Max (V): 5; ComponentLink2Description: Datasheet; PackageReference: WDFN-8-511BN; RoHS: Pb-Free; ComponentLink1Description: Manufacturer URL; PartNumber: EMI2121MTTAG; DatasheetVersion: Rev. 2; PackageVersion: Rev. A, 12/2012; PackageDescription: 8-Pin Small Outline No-Lead, Body 2.2 x 2 mm, Pitch 0.5 mm; Mounting Technology: Surface Mount; ComponentLink1URL: http://www.onsemi.com/; ComponentLink2URL: http://www.onsemi.com/pub_link/Collateral/EMI2121MT-D.PDF; Packing: Tape and Reel; ComponentLink3Description: Package Specification; ComponentLink3URL: http://www.onsemi.com/pub_link/Collateral/511BN.PDF
U2 = DRV2605L: 2 to 5.2 V Haptic Driver for LRA and ERM  With Effect Library and Smart-Loop Architecture
U3 = CMP-0095-00115-3: 8-bit AVR Microcontroller, 2.7-5.5V, 16KB Flash, 512 Bytes EEPROM, 512 Bytes SRAM, 32-pin VQFN, Industrial Grade (-40°C to 85°C); ComponentLink1Description: Manufacturer URL; RevisionNote: Schematic symbol corrected; ComponentLink3URL: http://www.atmel.com/dyn/resources/prod_documents/7799S.pdf; ComponentLink2URL: http://www.atmel.com/dyn/resources/prod_documents/doc7799.pdf; PackageReference: 32PG; DatasheetVersion: revD, Nov-2010; PartNumber: ATmega16U2-MU; PackageVersion: revA, Oct-2008; Code_JEDEC: MO-220WHHD-2; PackageDescription: 32-Pin Quad Flat No-Lead (QFN) Sawn,  5 x 5 x 1.0 mm Body, Pitch 0.50 mm, 3.60mm Exposed Pad; ComponentLink2Description: ATmega8U2/16U2/32U2 Datasheet; ComponentLink1URL: http://www.atmel.com/; ComponentLink3Description: ATmega8U2/16U2/32U2 Summary
X1 = CMP-1688-00003-1: Ceramic SMD Crystal, 16 MHz, +/- 20 ppm, 50 Ohm, -20 to 70 degC, 4-Pin SMD, RoHS, Tape and Reel; Current Rating: 1.82 A; Resistance: 0.033 Ohm; Tolerance: 30%; Shielding: Shielded; REACH SVHC: Unknown; RoHSCompliant: True; PackageReference: ABM3B; Mount: Surface Mount; Max Operating Temperature: 105degC; DatasheetVersion: Aug-15; Package Quantity: 500; PackageDescription: 4-Pin Surface Mount Device, Body 5 x 3.2 mm; ComponentLink2URL: http://www.abracon.com/Resonators/abm3b.pdf; Packaging: Tape and Reel; Height: 2.8 mm; ComponentLink1URL: http://www.abracon.com/; ComponentLink2Description: Datasheet; Length: 0.197 inch; ComponentLink1Description: Manufacturer URL; Case/Package: 5028; Width: 0.197 inch; Min Operating Temperature: -40degC

## Sheet LevelShifter.SchDoc
size A
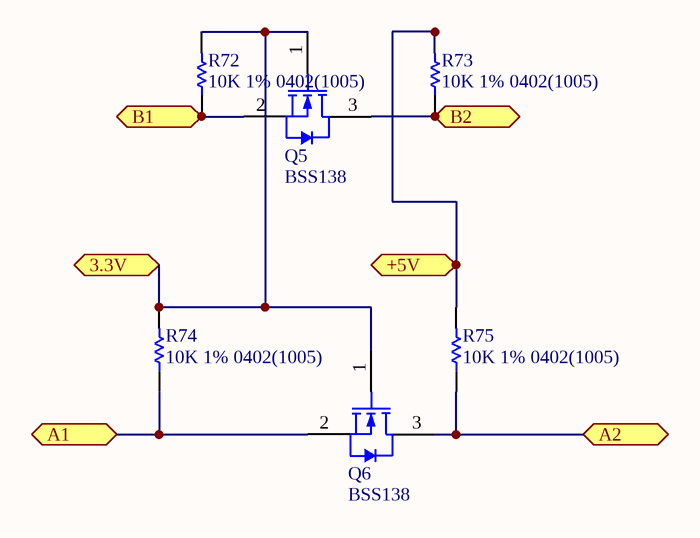
[diagram p3: LevelShifter.SchDoc]

### Parts
Q5  BSS138  [FAIR-SOT23-3_V]
Q6  BSS138  [FAIR-SOT23-3_V]
R72  10K 1% 0402(1005)  [RESC0402(1005)_L]
R73  10K 1% 0402(1005)  [RESC0402(1005)_L]
R74  10K 1% 0402(1005)  [RESC0402(1005)_L]
R75  10K 1% 0402(1005)  [RESC0402(1005)_L]

### Ports
3.3V, +5V, A1 (bidir), A2 (bidir), B1 (bidir), B2 (bidir)

### Nets
+3V3: Q5.1(G) Q6.1(G) R72.2 R74.2 ; port 3.3V
+5: R73.2 R75.2 ; port +5V
16U2 RX: Q6.3(D) R75.1 ; port A2
16U2 TX: Q5.3(D) R73.1 ; port B2
SAM_RX: Q5.2(S) R72.1 ; port B1
SAM_TX: Q6.2(S) R74.1 ; port A1

### Library data of the parts
Q5 Q6 = CMP-1670-00009-1: N-Channel Logic Level Enhancement Mode Field Effect Transistor, 220 mA, 50 V, -55 to 150 degC, 3-Pin SOT-23, RoHS, Tape and Reel; ESR: 40 Ohm; Tolerance: 30ppm; Capacitance: 1.8E-11 f; Load Capacitance: 18 pF; Frequency: 12 MHz; Resistance: 100 Ohm; Min Operating Temperature: -20degC; ComponentLink2URL: https://www.fairchildsemi.com/datasheets/BS/BSS138.pdf; Max Operating Temperature: 70degC; Width: 0.126 inch; Pins: 4; Length: 0.197 inch; ComponentLink2Description: Datasheet; Package Quantity: 1; PackageReference: SOT23-3; Packaging: Tape and Reel; RoHSCompliant: True; Frequency Tolerance: 30ppm; ComponentLink3Description: Package Specification; Mount: Surface Mount; REACH SVHC: Unknown; Height: 0.041 inch; ComponentLink1URL: https://www.fairchildsemi.com/; PackageDescription: 3-Pin Small Outline Transistor, Body 2.92 x 1.325 mm, Pitch 0.95 mm; ComponentLink3URL: http://www.fairchildsemi.com/dwg/MA/MA03D.pdf; ComponentLink1Description: Manufacturer URL; DatasheetVersion: Rev. C, 10/2005
R72-R75 = CMP-1011-00623-1: as R10 on sheet Interface; Technology: SMT; Tolerance: 1 %; Power: 0.063 W

## Sheet IR.SchDoc
size A
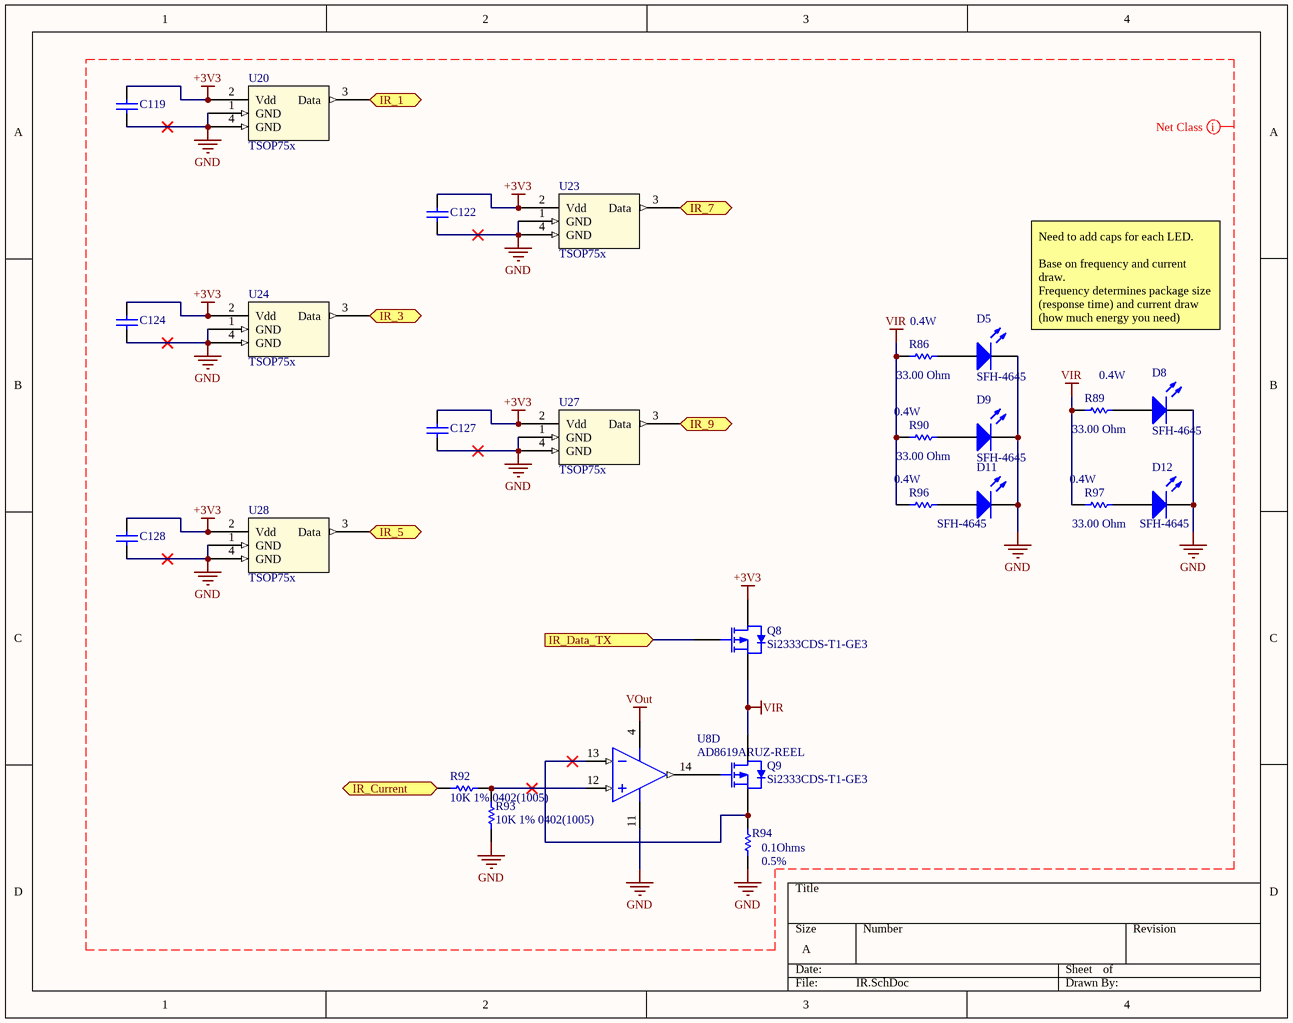
[diagram p4: IR.SchDoc]

### Parts
(Parts that share a designator on the sheet are numbered #1, #2 ... from top to bottom, then left to right.)
C119  CAP 100nF 10V 0402(1005)  [CAPC0402(1005)60_L]  (value not drawn)
C122  CAP 100nF 10V 0402(1005)  [CAPC0402(1005)60_L]  (value not drawn)
C124  CAP 100nF 10V 0402(1005)  [CAPC0402(1005)60_L]  (value not drawn)
C127  CAP 100nF 10V 0402(1005)  [CAPC0402(1005)60_L]  (value not drawn)
C128  CAP 100nF 10V 0402(1005)  [CAPC0402(1005)60_L]  (value not drawn)
D5  SFH-4645  [SFH-4645]
D8  SFH-4645  [SFH-4645]
D9  SFH-4645  [SFH-4645]
D11  SFH-4645  [SFH-4645]
D12  SFH-4645  [SFH-4645]
Q8  Si2333CDS-T1-GE3  [DIOD-SOT23-3_V]
Q9  Si2333CDS-T1-GE3  [DIOD-SOT23-3_V]
R86  value 33.00 Ohm  Power: 0.4W  [RESC0805(2012)_M]  (hidden comment: 33R 5% 0805(2012))
R89  value 33.00 Ohm  Power: 0.4W  [RESC0805(2012)_M]  (hidden comment: 33R 5% 0805(2012))
R90  value 33.00 Ohm  Power: 0.4W  [RESC0805(2012)_M]  (hidden comment: 33R 5% 0805(2012))
R92  10K 1% 0402(1005)  [RESC0402(1005)_L]
R93  10K 1% 0402(1005)  [RESC0402(1005)_L]
R94  value 0.1Ohms  Tolerance: 0.5%  [RESC1206(3216)_L]  (hidden comment: RES1206)
R96  Power: 0.4W  [RESC0805(2012)_M]  (hidden comment: 33R 5% 0805(2012))
R97  value 33.00 Ohm  Power: 0.4W  [RESC0805(2012)_M]  (hidden comment: 33R 5% 0805(2012))
U8#1  AD8619ARUZ-REEL  [ADI-RU-14_N]  (part D of 4)
U20  TSOP75x  [TSOP75x-TR]
U23  TSOP75x  [TSOP75x-TR]
U24  TSOP75x  [TSOP75x-TR]
U27  TSOP75x  [TSOP75x-TR]
U28  TSOP75x  [TSOP75x-TR]

### Ports
IR_1 (out), IR_3 (out), IR_5 (out), IR_7 (out), IR_9 (out), IR_Current (in), IR_Data_TX (in)

### Nets
+3V3: C119.1 C122.1 C124.1 C127.1 C128.1 Q8.3(D) U20.2(Vdd) U23.2(Vdd) U24.2(Vdd) U27.2(Vdd) U28.2(Vdd)
GND: C119.2 C122.2 C124.2 C127.2 C128.2 D5.2(K) D8.2(K) D9.2(K) D11.2(K) D12.2(K) R93.1 R94.1 U8#1.11(-V) U20.1(GND) U20.4(GND) U23.1(GND) U23.4(GND) U24.1(GND) U24.4(GND) U27.1(GND) U27.4(GND) U28.1(GND) U28.4(GND)
VIR: Q8.2(S) Q9.3(D) R86.1 R89.1 R90.1 R96.1 R97.1
VOut: U8#1.4(+V)
NetD5_1: D5.1(A) R86.2
NetD8_1: D8.1(A) R89.2
NetD9_1: D9.1(A) R90.2
NetD11_1: D11.1(A) R96.2
NetD12_1: D12.1(A) R97.2
NetQ8_1: Q8.1(G) ; port IR_Data_TX
NetQ9_1: Q9.1(G) U8#1.14(OUT_D)
NetQ9_2: Q9.2(S) R94.2 U8#1.13(-IN_D)
NetR67_2: R92.2 ; port IR_Current
NetR92_1: R92.1 R93.2 U8#1.12(+IN_D)
NetU17_A2: U24.3(Data) ; port IR_3
NetU17_A11: U20.3(Data) ; port IR_1
NetU17_C11: U27.3(Data) ; port IR_9
NetU17_K7: U28.3(Data) ; port IR_5
NetU17_M9: U23.3(Data) ; port IR_7

### Layout directives
net class IR: +3V3, GND, VIR, VOut

### Notes on the sheet
- (near D5) Need to add caps for each LED.
  Base on frequency and current draw.
  Frequency determines package size (response time) and current draw (how much energy you need) determines capacity.

### Library data of the parts
C119 C122 C124 C127 C128 = CMP-1034-02066-1: as C1 on sheet Interface; Max Thickness: 0.6 mm; Rated Voltage: 10 V; Technology: SMT; Value: 100nF
D5 D8 D9 D11 D12 = LED3: IR LED Toplooker; Published: 8-Jun-2000; LatestRevisionDate: 17-Dec-2003; LatestRevisionNote: PCB Footprint replaced.; DatasheetVersion: 16-Apr-2002; PackageVersion: 16-Apr-2002; PackageReference: 3.5X2.8X1.9; Publisher: Altium Limited; PackageDescription: SM LED; 2 C-Bend Leads; Body 3.5 x 2.8 x 1.9 mm, inc leads (LxWxH typ)
Q8 Q9 = CMP-00020-0000-A.2: as Q1 on sheet Interface; Tradename: TrenchFET; Standard Pack Qty: 3000; Reeling: True; Supplier Part Number: 781-SI2333CDS-T1-GE3; Series: SI2; Length: 3.04 mm; ComponentLink1URL: http://www.mouser.com/ds/2/427/si2333cd-244460.pdf; RoHS - Mouser: Y; Technology: Si; Width: 1.4 mm; Maximum Operating Temperature: + 150 C; Rds On - Drain-Source Resistance: 35 mOhms; Product: MOSFET Small Signal; Manufacturer Part Number: Si2333CDS-T1-GE3; Minimum Operating Temperature: - 55 C; Minimum Order Quantity: 1; Height: 1.02 mm; Supplier: Mouser; ComponentLink1Description: si2333cd-244460.pdf; Id - Continuous Drain Current: 5.1 A; Fall Time: 35 ns; Mounting Style: SMD/SMT; Package / Case: SOT-23-3; Packaging: Reel
R86 R89 R90 R96 R97 = CMP-1013-00038-1: 33R 0.125W 5% 0805 (2012 Metric)  SMD; Case-Metric: 2012; Case-EIA: 0805; Technology: SMT; Tolerance: 5 %
R92 R93 = CMP-1011-00623-1: as R10 on sheet Interface; Technology: SMT; Tolerance: 1 %; Power: 0.063 W
R94 = CMP-1591-00005-1: 1206 (3216 Metric) Chip Resistor; Case-Metric: 3216; Case-EIA: 1206; PackageReference: RESC1206(3216)
U8#1 = CMP-0384-01896-1: Quad Channel Single-Supply Operation Operational Amplifier, 400 KHz BW, 100 mV/us SR, Industrial, 14-pin SOP (RU-14), Reel; Generic Part Number: AD8619; Manufacturer: Analog Devices; Iq/Amp: 38uA; V Span Max: 5V; V Span Min: 1.8V; Input Bias Current: 200fA; Amplifiers Per Package: 4; Input Offset Voltage: 400uV; Small Signal Bandwidth: 400KHz; ComponentLink2Description: Datasheet; Mounting Technology: Surface Mount; PackageDescription: 14-Pin Thin Shrink Small Outline Package, Body 5 x 4.4 mm, Pitch 0.65 mm; DatasheetVersion: Rev. E; Code_JEDEC: MO-153AB-1; ComponentLink2URL: http://www.analog.com/static/imported-files/data_sheets/AD8613_8617_8619.pdf; ComponentLink3URL: http://www.analog.com/static/imported-files/packages/36057385283879153717235186773RU14.pdf; ComponentLink1Description: Manufacturer URL; ComponentLink3Description: Package Specification; Slew Rate: 100mV/us; ComponentLink1URL: http://www.analog.com/en/index.html; PartNumber: AD8619ARUZ-REEL; PackageReference: RU-14; PartId: 1
U20 U23 U24 U27 U28 = TSOP75x: miniaturized SMD IR receiver  modules for infrared remote control systems

## Sheet LEDs.SchDoc
size A
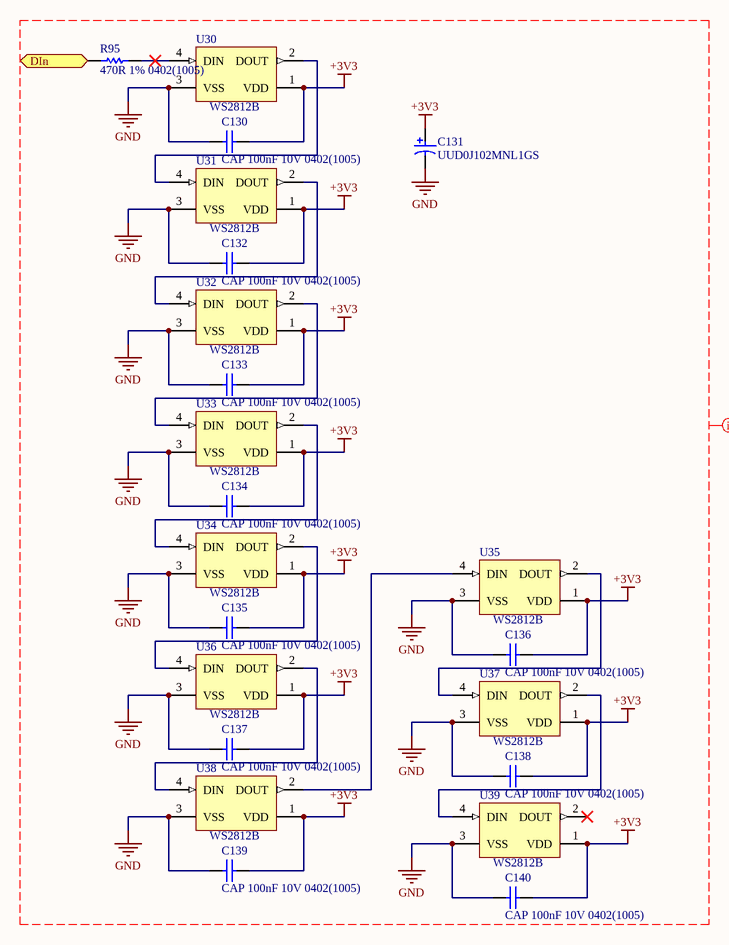
[diagram p5: LEDs.SchDoc]

### Parts
C130  CAP 100nF 10V 0402(1005)  [CAPC0402(1005)60_L]
C131  UUD0J102MNL1GS  [NIC-CAPA2-8X10_V]
C132  CAP 100nF 10V 0402(1005)  [CAPC0402(1005)60_L]
C133  CAP 100nF 10V 0402(1005)  [CAPC0402(1005)60_L]
C134  CAP 100nF 10V 0402(1005)  [CAPC0402(1005)60_L]
C135  CAP 100nF 10V 0402(1005)  [CAPC0402(1005)60_L]
C136  CAP 100nF 10V 0402(1005)  [CAPC0402(1005)60_L]
C137  CAP 100nF 10V 0402(1005)  [CAPC0402(1005)60_L]
C138  CAP 100nF 10V 0402(1005)  [CAPC0402(1005)60_L]
C139  CAP 100nF 10V 0402(1005)  [CAPC0402(1005)60_L]
C140  CAP 100nF 10V 0402(1005)  [CAPC0402(1005)60_L]
R95  470R 1% 0402(1005)  [RESC0402(1005)_L]
U30  WS2812B  [ADAI-WS2812B_V]
U31  WS2812B  [ADAI-WS2812B_V]
U32  WS2812B  [ADAI-WS2812B_V]
U33  WS2812B  [ADAI-WS2812B_V]
U34  WS2812B  [ADAI-WS2812B_V]
U35  WS2812B  [ADAI-WS2812B_V]
U36  WS2812B  [ADAI-WS2812B_V]
U37  WS2812B  [ADAI-WS2812B_V]
U38  WS2812B  [ADAI-WS2812B_V]
U39  WS2812B  [ADAI-WS2812B_V]

### Ports
DIn (in)

### Nets
+3V3: C130.1 C131.1 C132.1 C133.1 C134.1 C135.1 C136.1 C137.1 C138.1 C139.1 C140.1 U30.1(VDD) U31.1(VDD) U32.1(VDD) U33.1(VDD) U34.1(VDD) U35.1(VDD) U36.1(VDD) U37.1(VDD) U38.1(VDD) U39.1(VDD)
GND: C130.2 C131.2 C132.2 C133.2 C134.2 C135.2 C136.2 C137.2 C138.2 C139.2 C140.2 U30.3(VSS) U31.3(VSS) U32.3(VSS) U33.3(VSS) U34.3(VSS) U35.3(VSS) U36.3(VSS) U37.3(VSS) U38.3(VSS) U39.3(VSS)
NetR95_1: R95.1 ; port DIn
NetR95_2: R95.2 U30.4(DIN)
NetU30_2: U30.2(DOUT) U31.4(DIN)
NetU31_2: U31.2(DOUT) U32.4(DIN)
NetU32_2: U32.2(DOUT) U33.4(DIN)
NetU33_2: U33.2(DOUT) U34.4(DIN)
NetU34_2: U34.2(DOUT) U36.4(DIN)
NetU35_2: U35.2(DOUT) U37.4(DIN)
NetU35_4: U35.4(DIN) U38.2(DOUT)
NetU36_2: U36.2(DOUT) U38.4(DIN)
NetU37_2: U37.2(DOUT) U39.4(DIN)

Not connected (* = marked no-connect by the designer): U39 2(DOUT)*

### Layout directives
net class LEDs: +3V3, GND

### Library data of the parts
C130 C132-C140 = CMP-1034-02066-1: as C1 on sheet Interface; Max Thickness: 0.6 mm; Rated Voltage: 10 V; Technology: SMT; Value: 100nF
C131 = CMP-0687-00071-1: Aluminum Electrolytic Capacitor, UD Series, Low Impedance, 1000 uF, 6.3 V, + / - 20%, -55 to 105 degC, Chip Type, 8 x 10 mm D x L, Pb-Free, Reel; Manufacturer: Nichicon; Impedance: 0.17 Ohm; Endurance Time: 5000 h; Rated Capacitance: 1000 uF; Rated Ripple Current (at 100kHz): 450 mA; Rated Voltage: 6.3 V; Packing: Dia382mm Reel; Tolerance Rated Capacitance: -20 to 20%; Diameter: 8 mm; ComponentLink3Description: Package Specification; Mounting Technology: Surface Mount; RoHS: TRUE; ComponentLink3URL: http://products.nichicon.co.jp/en/pdf/XJA043/e-ud.pdf; Length: 10 mm; PackageDescription: 2-Pin Surface Mount Device, Diameter 8 mm, Height 10 mm, Pitch 6.5 mm; DatasheetVersion: 08/2012; ComponentLink2Description: Datasheet; PartNumber: UUD0J102MNL1GS; ComponentLink1URL: http://www.nichicon.co.jp/; ComponentLink1Description: Manufacturer URL; ComponentLink2URL: http://products.nichicon.co.jp/en/pdf/XJA043/e-ud.pdf; PackageReference: CAPAE-D8H10
R95 = CMP-1011-00473-1: 470R 0.063W 1% 0402 (1005 Metric)  SMD; Case-Metric: 1005; Case-EIA: 0402; Value: 470.00 Ohm; Tolerance: 1 %; Technology: SMT; Power: 0.063 W
U30-U39 = CMP-1740-00005-1: Intelligent Control LED Integrated Light Source, 3.5 to 5.3 V, -25 to 80 degC, 4-Pin SMD, RoHS, Bulk; Case\Package: Radial; Shielding: Unshielded; Current Rating: 240 mA; Tolerance: 10%; Mount: Through Hole; Max Operating Temperature: 125 degC; Radiation Hardening: No; Length: 12.2 mm; Min Operating Temperature: -55 degC; ComponentLink1URL: https://www.adafruit.com/; Packaging: Bulk; Lead Pitch: 5 mm; RoHSCompliant: true; Pins: 2; Package Quantity: 200; ComponentLink2URL: https://cdn-shop.adafruit.com/datasheets/WS2812B.pdf; ComponentLink2Description: Datasheet; PackageDescription: 4-Pin Surface Mount Device, Body 5 x 5 mm, Pitch 3.3 mm; PackageReference: WS2812B; Height: 12.2 mm; REACH SVHC: No SVHC; ComponentLink1Description: Manufacturer URL; DatasheetVersion: May-13